# EAGLE design ADC (EAGLE 6.4)
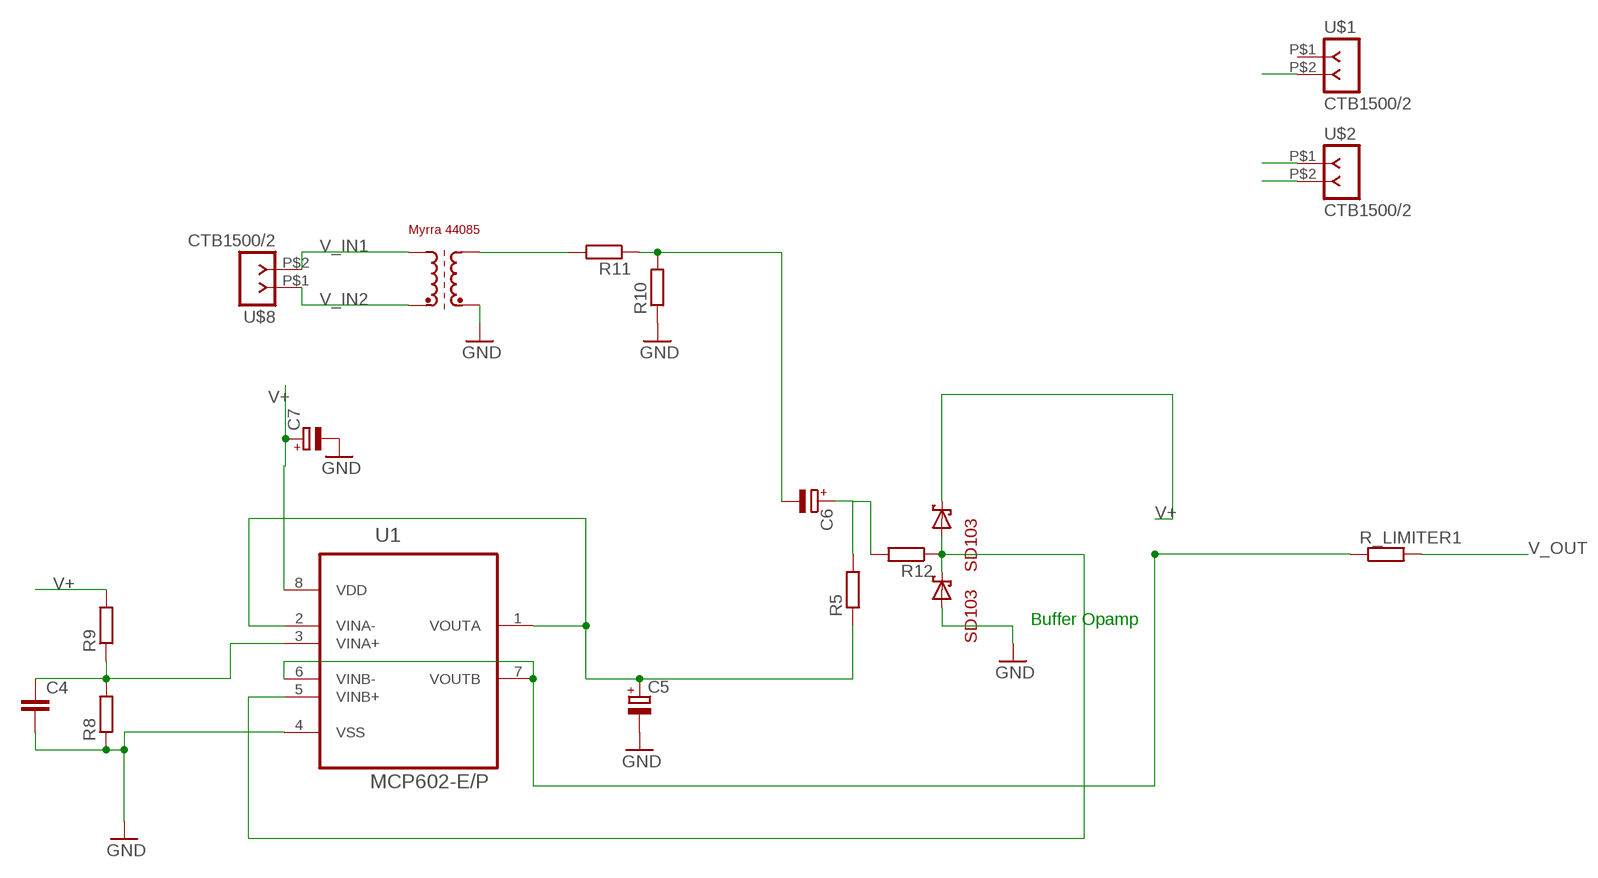
[diagram p0: schematic, sheet 1]

## Parts
C4  C5P  [C050-030-075]
C5  CPOL1  [E2,5-7---100UF]
C6  CPOL1  [E2,5-7---100UF]
C7  CPOL1  [E2,5-7---100UF]
R5  R  [0207/10]
R8  R  [0207/10]
R9  R  [0207/10]
R10  R  [0207/10]
R11  R  [0207/10]
R12  R  [0207/10]
R_LIMITER1  R  [0207/10]
U1  MCP602-E/P  [DIP254P762X508-8P]
U$1  CTB1500/2  [CTB1500-2]
U$2  CTB1500/2  [CTB1500-2]
U$5  MYRRA_4408  [4408]
U$6  SD103A  [D035-10]
U$7  SD103A  [D035-10]
U$8  CTB1500/2  [CTB1500-2]

## Nets
GND: C4.2 C5.- C7.- R8.1 R10.1 U1.4(VSS) U$2.P$1 U$5.PIN9(E2) U$7.A
N$1: R_LIMITER1.1 U1.6(VINB-) U1.7(VOUTB)
N$2: C5.+ R5.1 U1.1(VOUTA) U1.2(VINA-)
N$10: C4.1 R8.2 R9.1 U1.3(VINA+)
N$12: R12.1 U1.5(VINB+) U$6.A U$7.C
N$17: C6.- R10.2 R11.1
N$18: R11.2 U$5.PIN7(A2)
N$21: C6.+ R5.2 R12.2
V+: C7.+ R9.2 U1.8(VDD) U$1.P$2 U$6.C
V_IN1: U$5.PIN5(A1) U$8.P$2
V_IN2: U$5.PIN1(E1) U$8.P$1
V_OUT: R_LIMITER1.2 U$2.P$2
Unconnected: U$1.P$1

## Notes on the sheet
- Buffer Opamp

## Library data of the parts
C4 = ee2parts:C: Capacitor
C5-C7 = ee2parts:CPOL: Electrolytic (polarised) capacitor
R5 R8-R12 R_LIMITER1 = ee2parts:R: Resistor
U1 = MCP:MCP602-E/P: IC, 2.7V to 5.5V Single-Supply CMOS Dual Op Amps,DIP-8; MPN: MCP602-E/P; OC_FARNELL: 1852042; OC_NEWARK: 88H9870; PACKAGE: DIP-8; SUPPLIER: Microchip
U$1 U$2 U$8 = eko-parts:CTB1500/2
U$5 = Pauls_parts:MYRRA_4408
U$6 U$7 = Pauls_parts:SD103A

## Board
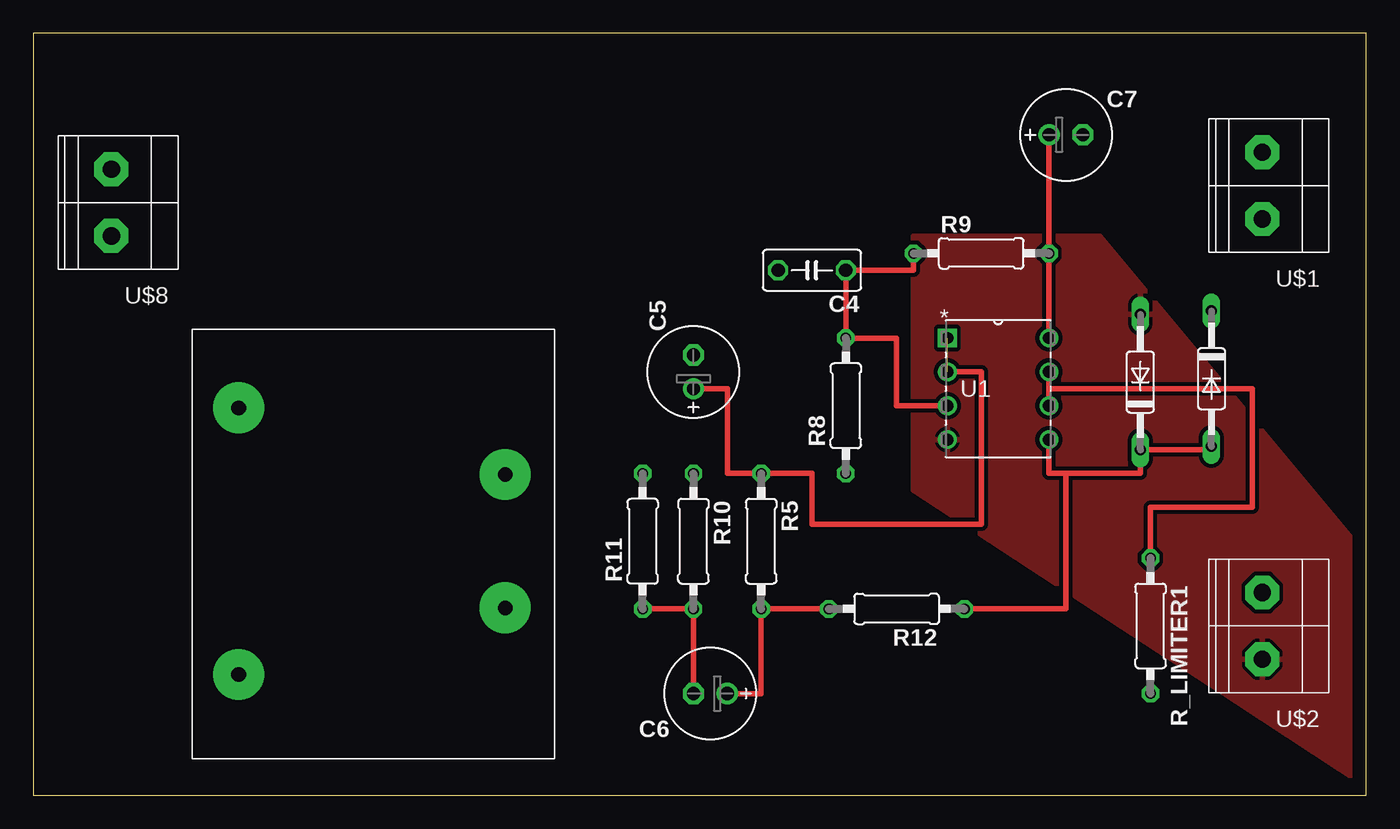
[diagram p1: board, top side]
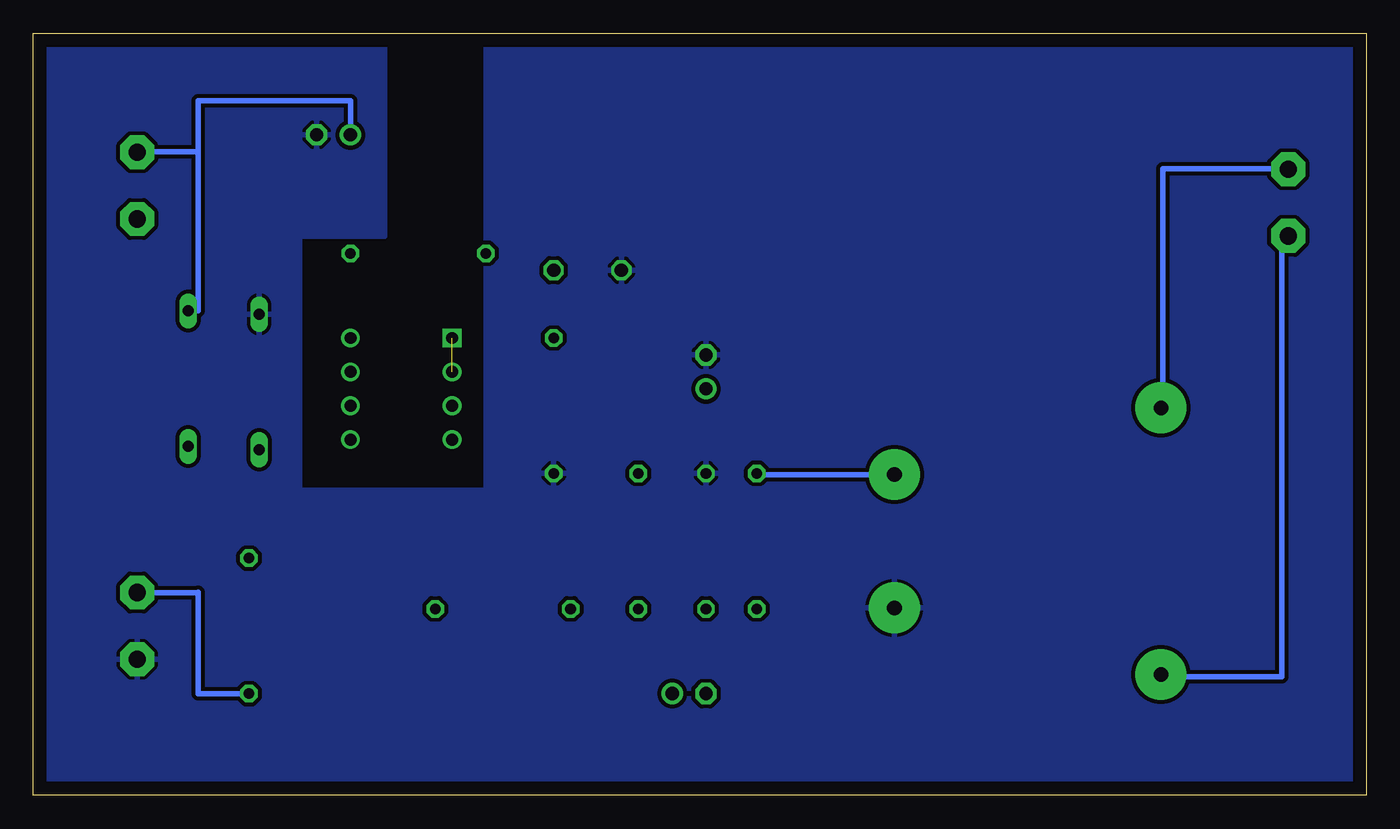
[diagram p2: board, bottom side, seen from below]

Size 100 x 57.14 mm. Coordinates in mm from the lower left corner, seen from the top.
Outline: 0,0 100,0 100,57.14 0,57.14 0,0
Copper layers (1*16): Top 0.035mm / dielectric 1.5mm / Bottom 0.035mm
Design rules "default *": minimum track width 10mil, minimum drill 24mil, track to track 12mil, track to pad 12mil, pad to pad 12mil, via to via 12mil, smd to smd 12mil, copper to edge 40mil, drill to drill 12mil, minimum pad ring 10mil, minimum via ring 8mil, stop-mask expansion 4mil, vias tented up to drill 0mil, thermal gap 10mil

### Footprints (pad centres in the part's own frame; a part is rotated, then mirrored left to right if it is on the bottom)
C050-030-075 = drill 1 octagon: 1 -2.54,0; 2 2.54,0
E2,5-7---100UF = drill 1 pad 1.6: + -1.27,0 | drill 1 pad 1.6 octagon: - 1.27,0
0207/10 = drill 0.8 octagon: 1 -5.08,0; 2 5.08,0
DIP254P762X508-8P = drill 0.889 square: 1 -7.62,7.62 | drill 0.889: 2 -7.62,5.08; 3 -7.62,2.54; 4 -7.62,0; 5 0,0; 6 0,2.54; 7 0,5.08; 8 0,7.62
CTB1500-2 = drill 1.3 pad 2.54 octagon: P$1 -2.5,0.5; P$2 2.5,0.5
4408 = drill 1.1 pad 3.81: PIN1 -10,10; PIN5 10,10; PIN7 5,-10; PIN9 -5,-10
D035-10 = drill 0.813 long: A 4.318,0.762; C -5.842,0.762

### Placement (x,y rotation side)
C4  58.42,39.37 180 top
C5  49.53,31.75 90 top
C6  50.8,7.62 180 top
C7  77.47,49.53 0 top
R5  54.61,19.05 270 top
R8  60.96,29.21 90 top
R9  71.12,40.64 0 top
R10  49.53,19.05 270 top
R11  45.72,19.05 90 top
R12  64.77,13.97 180 top
R_LIMITER1  83.82,12.7 270 top
U1  76.2,26.67 0 top
U$1  92.71,45.72 90 top
U$2  92.71,12.7 90 top
U$5  25.4,19.05 90 top
U$6  87.63,30.48 270 top
U$7  83.82,31.75 90 top
U$8  6.35,44.45 90 top

### Tracks (layer width: path | path; a pad name or v marks a point on that pad's centre or on a via)
GND
  pour Bottom: 0,57.15 66.04,57.15 66.04,22.86 80.01,22.86 80.01,41.91 73.66,41.91 73.66,57.15 100.33,57.15 100.33,0 0,0
  pour Top: 66.04,41.91 80.01,41.91 99.06,19.05 99.06,1.27 66.04,22.86
N$1
  Top 0.406: R_LIMITER1.1 83.82,21.59 91.44,21.59 91.44,30.48 76.2,30.48 U1.7 U1.6
N$2  (1 unrouted)
  Top 0.406: C5.+ 52.07,30.48 52.07,24.13 R5.1 58.42,24.13 58.42,20.32 71.12,20.32 71.12,31.75 U1.2
N$10
  Top 0.406: U1.3 64.77,29.21 64.77,34.29 R8.2 C4.1 66.04,39.37 R9.1
N$12
  Top 0.406: U1.5 76.2,24.13 77.47,24.13 | 77.47,24.13 83.06,24.13 U$7.C 88.39,25.91 U$6.A | R12.1 77.47,13.97 77.47,24.13
N$17
  Top 0.406: R11.1 R10.2 C6.-
N$18
  Bottom 0.406: U$5.PIN7 45.72,24.05 R11.2
N$21
  Top 0.406: R12.2 R5.2 54.61,7.62 C6.+
V+
  Top 0.406: U1.8 R9.2 C7.+
  Bottom 0.406: U$6.C 87.63,36.32 87.63,48.26 | 87.63,48.26 92.21,48.26 U$1.P$2 | C7.+ 76.2,52.07 87.63,52.07 87.63,48.26
V_IN1
  Bottom 0.406: U$5.PIN5 15.24,29.05 15.24,46.99 5.85,46.99 U$8.P$2
V_IN2
  Bottom 0.406: U$8.P$1 6.35,41.95 6.35,8.89 15.4,8.89 U$5.PIN1
V_OUT
  Bottom 0.406: U$2.P$2 87.63,15.2 | 87.63,15.2 87.63,15.24 | 87.63,15.2 87.63,7.62 R_LIMITER1.2